# Altium schematic sheet bhi260ap.SchDoc
size A4
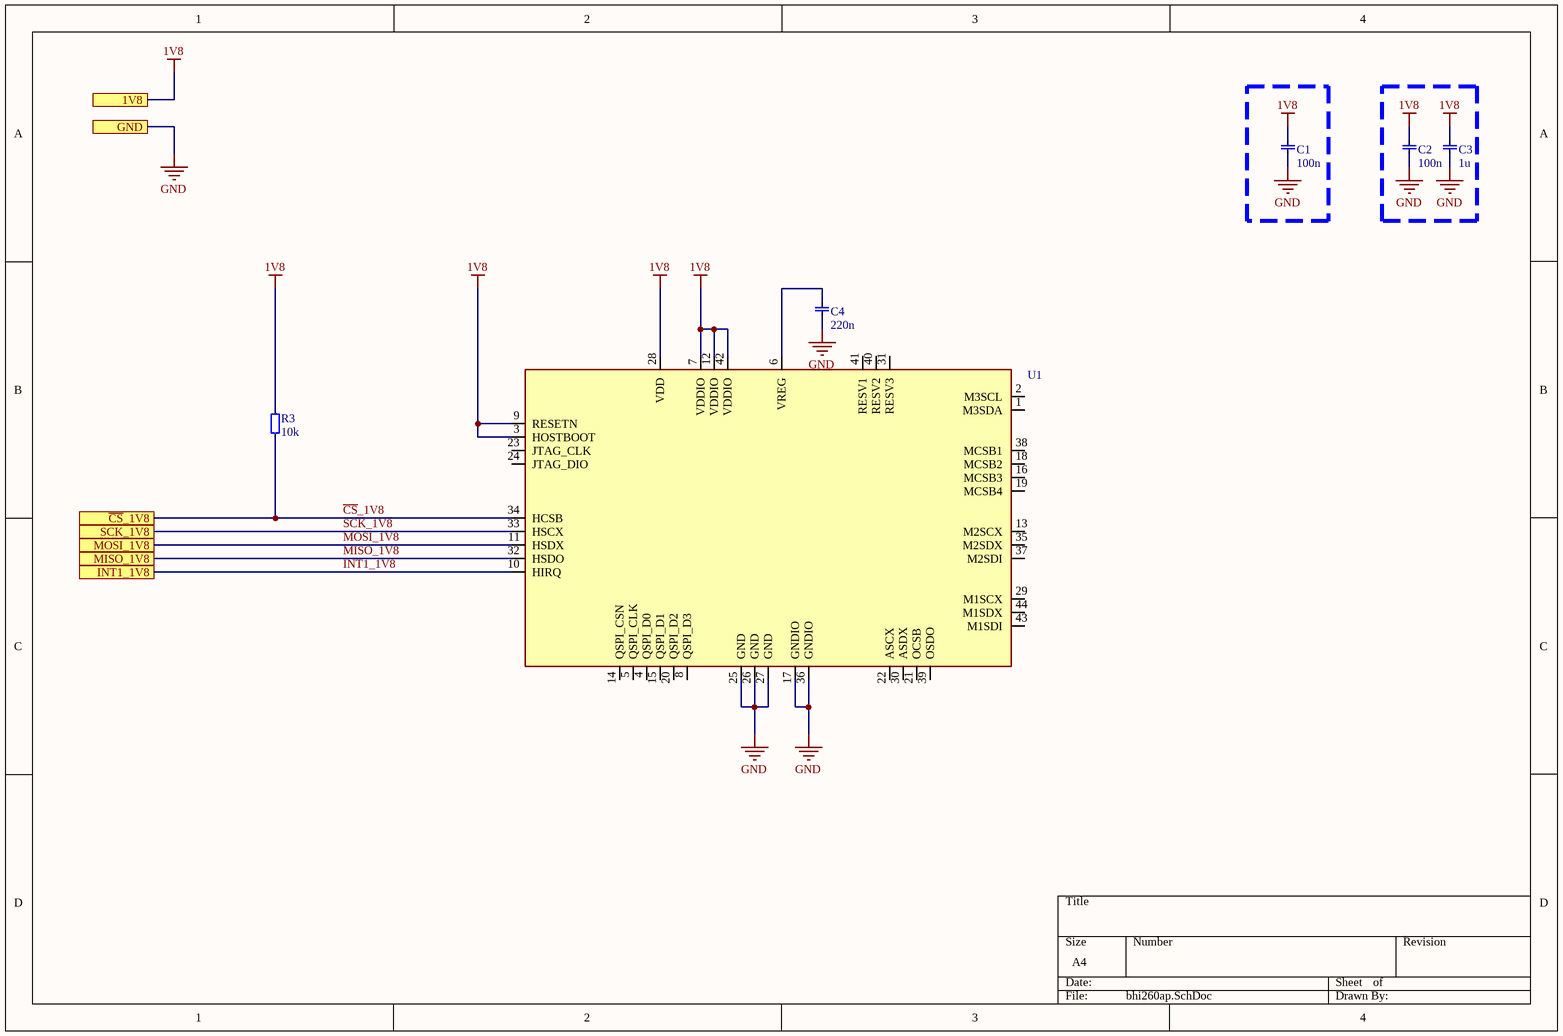
[diagram p0: bhi260ap.SchDoc]

## Parts
C1  value 100n  [0402 CAP]  (hidden comment: 0402 capacitor)
C2  value 100n  [0402 CAP]  (hidden comment: 0402 capacitor)
C3  value 1u  [0402 CAP]  (hidden comment: 0402 capacitor)
C4  value 220n  [0402 CAP]  (hidden comment: 0402 capacitor)
R3  value 10k  [0402 res]  (hidden comment: 0402, resistor)
U1  BHI260AP  [44-LGA]  (value not drawn)

## Ports
1V8, GND, INT1_1V8, MISO_1V8, MOSI_1V8, SCK_1V8, ~{CS}_1V8

## Nets
1V8: C1.1 C2.1 C3.1 R3.0 U1.3(HOSTBOOT) U1.7(VDDIO) U1.9(RESETN) U1.12(VDDIO) U1.28(VDD) U1.42(VDDIO) ; port 1V8
GND: C1.0 C2.0 C3.0 C4.0 U1.17(GNDIO) U1.25(GND) U1.26(GND) U1.27(GND) U1.36(GNDIO) ; port GND
~{CS}_1V8: R3.1 U1.34(HCSB) ; port ~{CS}_1V8
INT1_1V8: U1.10(HIRQ) ; port INT1_1V8
MISO_1V8: U1.32(HSDO) ; port MISO_1V8
MOSI_1V8: U1.11(HSDX) ; port MOSI_1V8
SCK_1V8: U1.33(HSCX) ; port SCK_1V8
NetC4_1: C4.1 U1.6(VREG)

Not connected (* = marked no-connect by the designer): U1 1(M3SDA) 2(M3SCL) 4(QSPI_D0) 5(QSPI_CLK) 8(QSPI_D3) 13(M2SCX) 14(QSPI_CSN) 15(QSPI_D1) 16(MCSB3) 18(MCSB2) 19(MCSB4) 20(QSPI_D2) 21(OCSB) 22(ASCX) 23(JTAG_CLK) 24(JTAG_DIO) 29(M1SCX) 30(ASDX) 31(RESV3) 35(M2SDX) 37(M2SDI) 38(MCSB1) 39(OSDO) 40(RESV2) 41(RESV1) 43(M1SDI) 44(M1SDX)

## Library data of the parts
U1 = BHI260AP: Self-learning AI smart sensor with integrated IMU